# Altium project BW1098OAK.PrjPcb (part 4 of 5)

## Sheet BW1098OAK_USB.SchDoc: =project_title
size Tabloid; PageSetup: Record=PageOptions|CenterHorizontal=True|CenterVertical=True|PrintScale=0.73|XCorrection=1.00|YCorrection=1.00|PrintKind=0|BorderSize=5000000|LeftOffset=0|BottomOffset=0|Orientation=2|PaperLength=1000|PaperWidth=1000|Scale=100|PaperSource=7|PrintQuality=-4|MediaType=1|DitherType=10|PaperKind=A4|PrintScaleMode=1; CompanyName: Luxonis Holding; DrawnBy: Brian Weinstein; Organization: Luxonis Holding; Address1: 1925 Harmony Park Drive; Address2: Westminster, CO; Address3: 80234; Address4: United States; DocumentNumber: DXXXX; Revision: R1M0E1; SheetNumber: 11; SheetTotal: 11
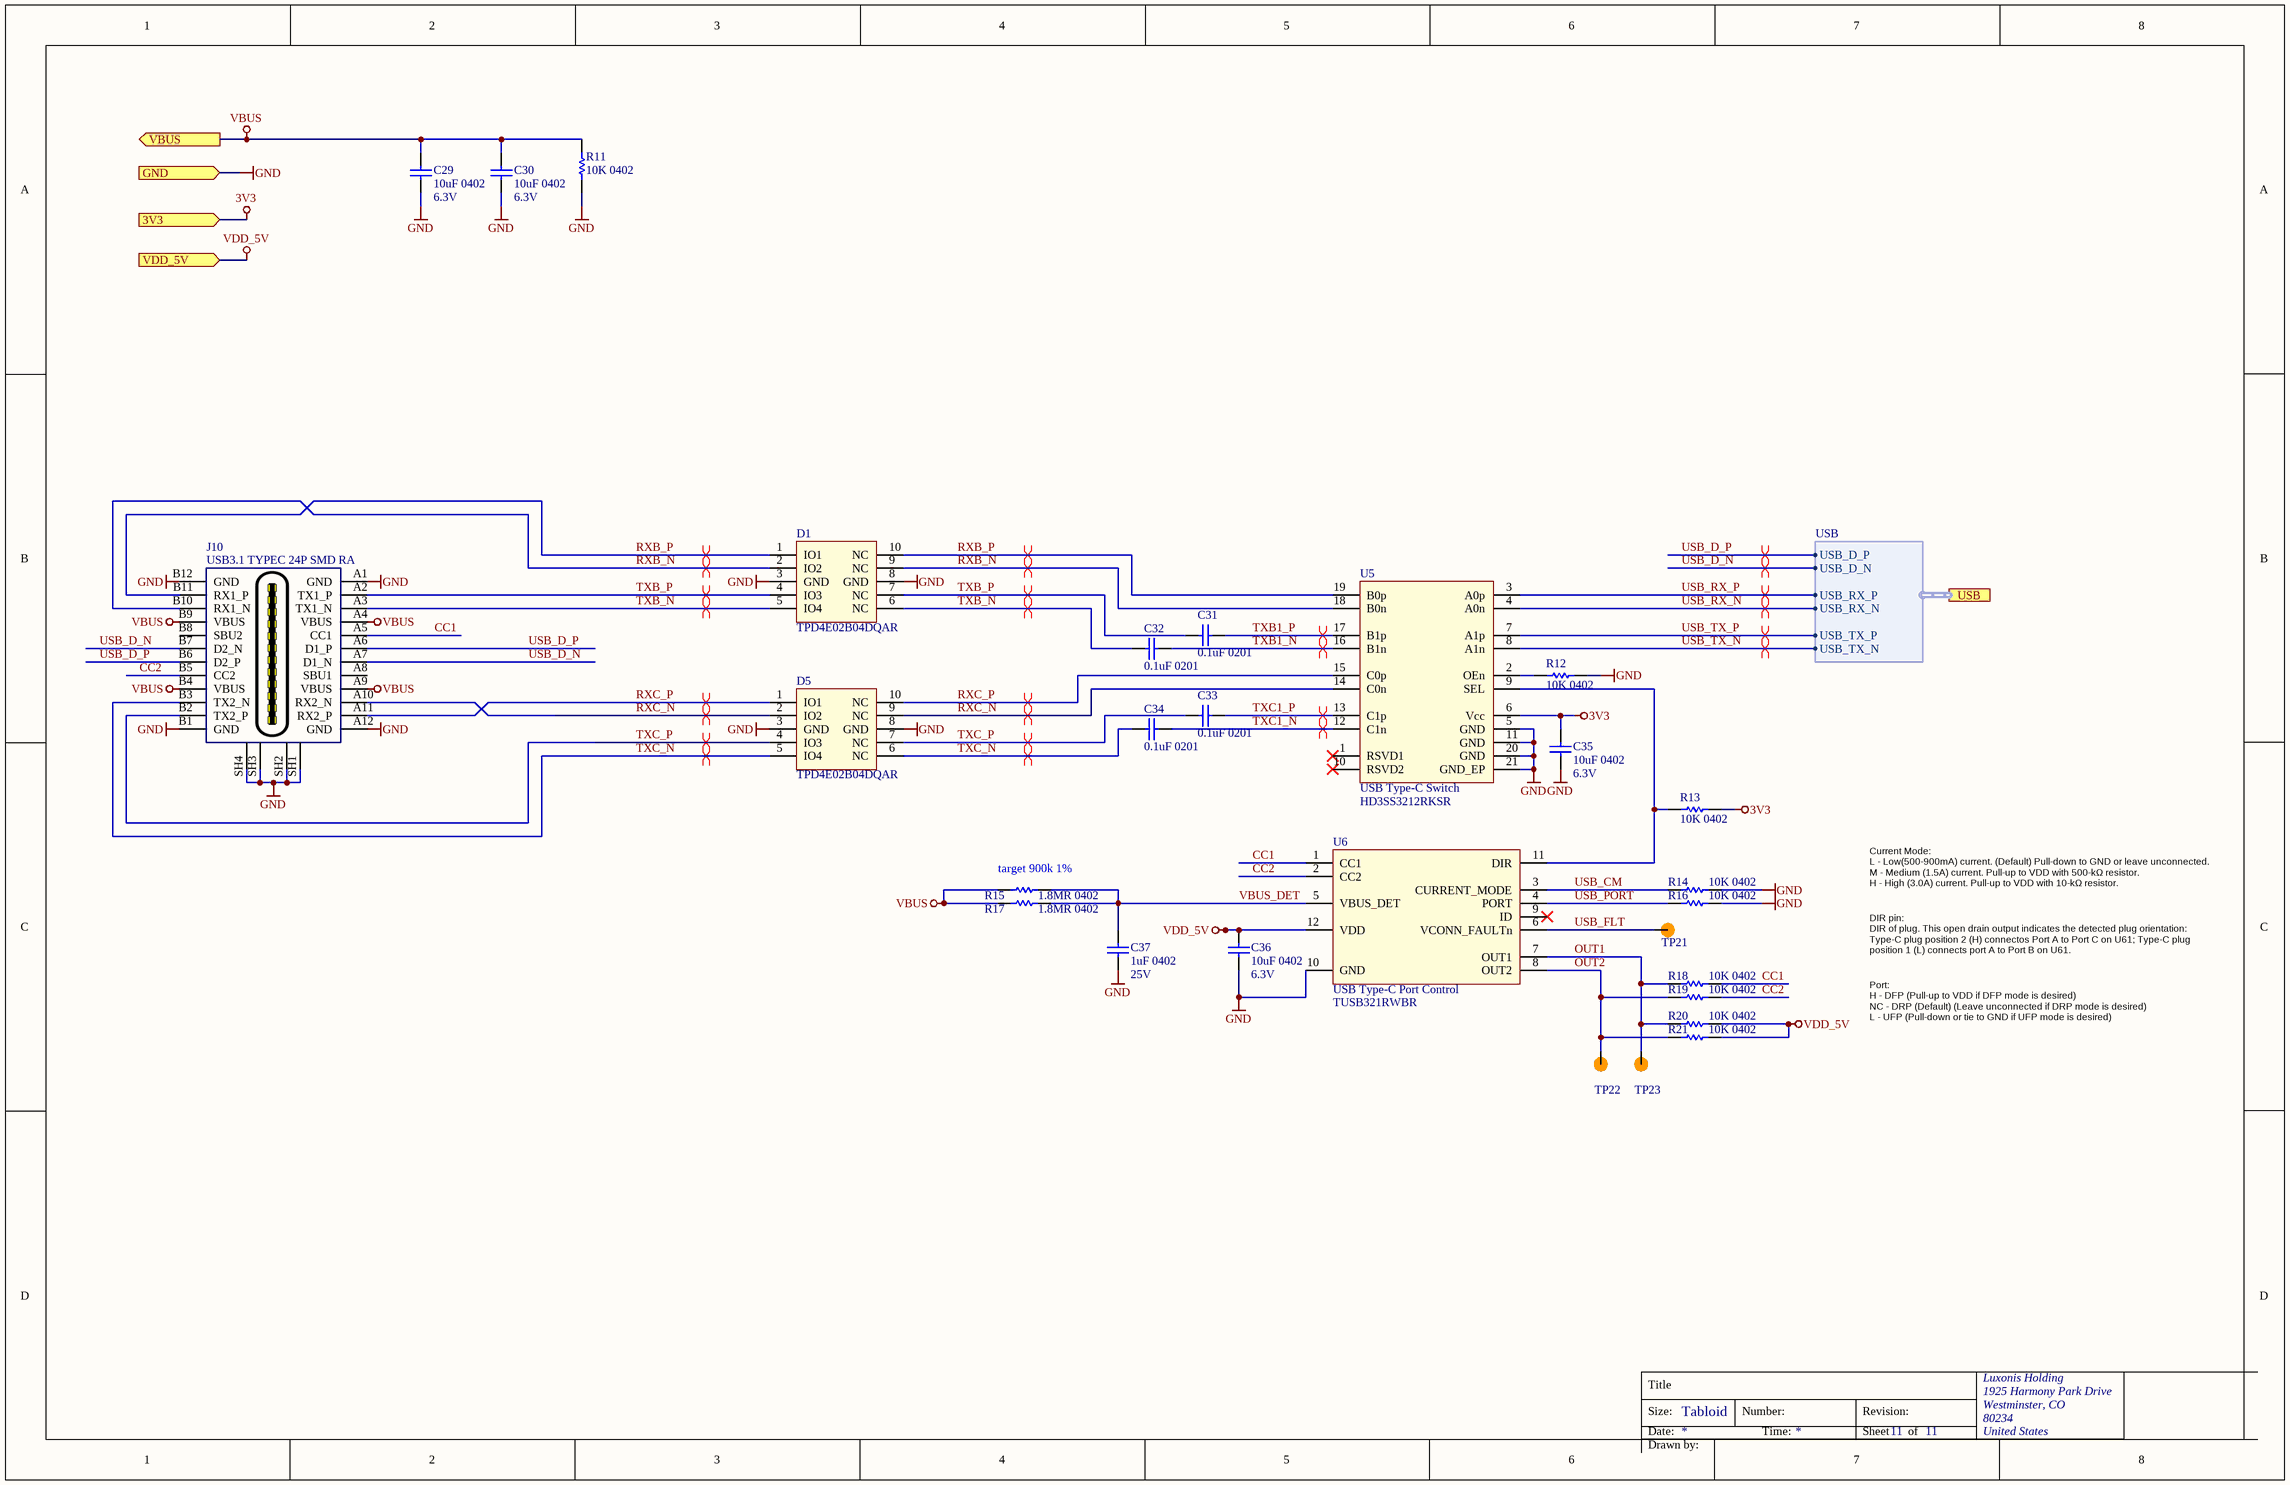
[diagram p6: BW1098OAK_USB.SchDoc]

### Parts
C29  10uF 0402  Voltage Rating: 6.3V  [CAPC0402(1005)70_L]
C30  10uF 0402  Voltage Rating: 6.3V  [CAPC0402(1005)70_L]
C31  0.1uF 0201  [CAPC0201(0603)33_L]
C32  0.1uF 0201  [CAPC0201(0603)33_L]
C33  0.1uF 0201  [CAPC0201(0603)33_L]
C34  0.1uF 0201  [CAPC0201(0603)33_L]
C35  10uF 0402  Voltage Rating: 6.3V  [CAPC0402(1005)70_L]
C36  10uF 0402  Voltage Rating: 6.3V  [CAPC0402(1005)70_L]
C37  1uF 0402  Voltage Rating: 25V  [CAPC0402(1005)70_N]
D1  TPD4E02B04DQAR  [TPD4E02B04DQAR]
D5  TPD4E02B04DQAR  [TPD4E02B04DQAR]
J10  USB3.1 TYPEC 24P SMD RA  [105450-0101]
R11  10K 0402  [RESC0402(1005)_L]
R12  10K 0402  [RESC0402(1005)_L]
R13  10K 0402  [RESC0402(1005)_L]
R14  10K 0402  [RESC0402(1005)_L]
R15  1.8MR 0402  [RESC0402(1005)_L]
R16  10K 0402  [RESC0402(1005)_L]
R17  1.8MR 0402  [RESC0402(1005)_L]
R18  10K 0402  [RESC0402(1005)_L]
R19  10K 0402  [RESC0402(1005)_L]
R20  10K 0402  [RESC0402(1005)_L]
R21  10K 0402  [RESC0402(1005)_L]
TP21  TP100_200_NS  [TP100_200_NS]  (value not drawn)  (no BOM)
TP22  TP100_200_NS  [TP100_200_NS]  (value not drawn)  (no BOM)
TP23  TP100_200_NS  [TP100_200_NS]  (value not drawn)  (no BOM)
U5  USB Type-C Switch  [HD3SS3212RKSR]
U6  USB Type-C Port Control  [TUSB321RWBR]

### Ports
3V3 (in), GND (in), USB (harness USB), VBUS (out), VDD_5V (in)

### Harnesses
USB: USB_D_P, USB_D_N, USB_TX_N, USB_TX_P, USB_RX_N, USB_RX_P

### Nets
3V3: C35.2 R13.2 U5.6(Vcc) ; port 3V3
GND: C29.1 C30.1 C35.1 C36.1 C37.1 D1.3(GND) D1.8(GND) D5.3(GND) D5.8(GND) J10.A1(GND) J10.A12(GND) J10.B1(GND) J10.B12(GND) J10.SH1(SH) J10.SH2(SH) J10.SH3(SH) J10.SH4(SH) R11.1 R12.2 R14.2 R16.2 U5.5(GND) U5.11(GND) U5.20(GND) U5.21(GND_EP) U6.10(GND) ; port GND
VBUS: C29.2 C30.2 J10.A4(VBUS) J10.A9(VBUS) J10.B4(VBUS) J10.B9(VBUS) R11.2 R15.1 R17.1 ; port VBUS
VDD_5V: C36.2 R20.2 R21.2 U6.12(VDD) ; port VDD_5V
CC1: J10.A5(CC1) R18.2 U6.1(CC1)
CC2: J10.B5(CC2) R19.2 U6.2(CC2)
OUT1: R18.1 R20.1 TP23.1 U6.7(OUT1)
OUT2: R19.1 R21.1 TP22.1 U6.8(OUT2)
RXB_N: D1.2(IO2) D1.9(NC) J10.B10(RX1_N) U5.18(B0n)
RXB_P: D1.1(IO1) D1.10(NC) J10.B11(RX1_P) U5.19(B0p)
RXC_N: D5.2(IO2) D5.9(NC) J10.A10(RX2_N) U5.14(C0n)
RXC_P: D5.1(IO1) D5.10(NC) J10.A11(RX2_P) U5.15(C0p)
TXB1_N: C32.2 U5.16(B1n)
TXB1_P: C31.2 U5.17(B1p)
TXB_N: C32.1 D1.5(IO4) D1.6(NC) J10.A3(TX1_N)
TXB_P: C31.1 D1.4(IO3) D1.7(NC) J10.A2(TX1_P)
TXC1_N: C34.2 U5.12(C1n)
TXC1_P: C33.2 U5.13(C1p)
TXC_N: C34.1 D5.5(IO4) D5.6(NC) J10.B3(TX2_N)
TXC_P: C33.1 D5.4(IO3) D5.7(NC) J10.B2(TX2_P)
USB_CM: R14.1 U6.3(CURRENT_MODE)
USB_D_N: J10.A7(D1_N) J10.B7(D2_N) ; port USB.USB_D_N
USB_D_P: J10.A6(D1_P) J10.B6(D2_P) ; port USB.USB_D_P
USB_FLT: TP21.1 U6.6(VCONN_FAULTn)
USB_PORT: R16.1 U6.4(PORT)
USB_RX_N: U5.4(A0n) ; port USB.USB_RX_N
USB_RX_P: U5.3(A0p) ; port USB.USB_RX_P
USB_TX_N: U5.8(A1n) ; port USB.USB_TX_N
USB_TX_P: U5.7(A1p) ; port USB.USB_TX_P
VBUS_DET: C37.2 R15.2 R17.2 U6.5(VBUS_DET)
NetR12_1: R12.1 U5.2(OEn)
NetR13_1: R13.1 U5.9(SEL) U6.11(DIR)

Not connected (* = marked no-connect by the designer): J10 A8(SBU1) B8(SBU2); U5 1(RSVD1)* 10(RSVD2)*; U6 9(ID)*

### Layout directives
differential pair; differential pair class USB3: RXB_N, RXB_P, RXC_N, RXC_P, TXB1_N, TXB1_P, TXB_N, TXB_P, TXC1_N, TXC1_P, TXC_N, TXC_P, USB_D_N, USB_D_P, USB_RX_N, USB_RX_P, USB_TX_N, USB_TX_P

### Notes on the sheet
- (near R15) target 900k 1%
- Current Mode:
  L - Low(500-900mA) current. (Default) Pull-down to GND or leave unconnected.
  M - Medium (1.5A) current. Pull-up to VDD with 500-kΩ resistor.
  H - High (3.0A) current. Pull-up to VDD with 10-kΩ resistor.
- DIR pin:
  DIR of plug. This open drain output indicates the detected plug orientation: Type-C plug position 2 (H) connectos Port A to Port C on U61; Type-C plug position 1 (L) connects port A to Port B on U61.
- Port:
  H - DFP (Pull-up to VDD if DFP mode is desired)
  NC - DRP (Default) (Leave unconnected if DRP mode is desired)
  L - UFP (Pull-down or tie to GND if UFP mode is desired)
- Title
- Size:
- Date:
- Tabloid
- Number:
- Time:
- Revision:
- Sheet
- of
- Drawn by:

### Library data of the parts
C29 C30 C35 C36 = GRM155R60J106ME15D: CAP CER 10UF 6.3V X5R 0402 20%; Manufacturer 1: Murata; Supplier 1: Digi-Key; Manufacturer Part Number 1: GRM155R60J106ME15D; Stock 1: 1839627; Pricing 1: 1=0.23000, 10=0.15700, 100=0.07950, 500=0.05442, 1000=0.04814, 2500=0.04605, 5000=0.04186 (USD); RoHS: Yes; Mount: Surface Mount; Case/Package: 0402; Case Code (Metric): 1005; Case Code (Imperial): 0402; Min Operating Temperature: -55°C; Max Operating Temperature: 85°C; Packaging: Tape and Reel; Capacitance: 10uF; Dielectric: X5R; Length: 0.039inch; Width: 0.02inch; ComponentLink1URL: https://www.murata.com/~/media/webrenewal/support/library/catalog/products/capacitor/mlcc/c02e.ashx?la=en-us&src-supplier=Digi-Key; ComponentLink1Description: https://www.murata.com/~/media/webrenewal/support/library/catalog/products/capacitor/mlcc/c02e.ashx?la=en-us&src-supplier=Digi-Key; Supplier Part Number 1: 490-13238-1-ND; Voltage Rating (DC): 6.3V; Thickness: 0.026inch; Tolerance: 20%
C31-C34 = GRM033R61A104KE15D: CAP CER 0.1UF 10V X5R 0201; Manufacturer 1: Murata; Capacitance: 100nF; Tolerance: 10%; Supplier 1: Digi-Key; Manufacturer Part Number 1: GRM033R61A104KE15D; Stock 1: 45335312; Pricing 1: 1=0.10000, 10=0.04200, 100=0.01860, 500=0.01330, 1000=0.01045, 2500=0.00950, 5000=0.00874 (USD); RoHS: Yes; Mount: Surface Mount; Case/Package: 0201; Weight: 6E-06oz; Case Code (Metric): 0603; Case Code (Imperial): 0201; Min Operating Temperature: -55°C; Max Operating Temperature: 85°C; Packaging: Tape and Reel; Voltage Rating: 10V; Package Quantity: 1; Voltage Rating (DC): 10V; Dielectric: X5R; Termination: SMD/SMT; Length: 0.6mm; Height: 0.3mm; Width: 0.012inch; Thickness: 0.013inch; Depth: 0.3mm; Radiation Hardening: No; Lead Free: Lead Free; REACH SVHC: No SVHC; ComponentLink1URL: https://datasheet.ciiva.com/26843/getdatasheetpartid-308656-26843739.pdf?src-supplier=Verical; ComponentLink1Description: https://datasheet.ciiva.com/26843/getdatasheetpartid-308656-26843739.pdf?src-supplier=Verical; ComponentLink2URL: https://datasheet.ciiva.com/5413/product-5413117.pdf?src-supplier=Mouser; ComponentLink2Description: https://datasheet.ciiva.com/5413/product-5413117.pdf?src-supplier=Mouser; ComponentLink3URL: https://datasheet.ciiva.com/6256/partnumbering-e-01-6256406.pdf?src-supplier=Digi-Key; ComponentLink3Description: https://datasheet.ciiva.com/6256/partnumbering-e-01-6256406.pdf?src-supplier=Digi-Key; ComponentLink4URL: https://datasheet.ciiva.com/6256/partnumbering-e-01-6256407.pdf?src-supplier=Digi-Key; ComponentLink4Description: https://datasheet.ciiva.com/6256/partnumbering-e-01-6256407.pdf?src-supplier=Digi-Key; ComponentLink5URL: https://datasheet.ciiva.com/6256/partnumbering-e-01-6256408.pdf?src-supplier=Digi-Key; ComponentLink5Description: https://datasheet.ciiva.com/6256/partnumbering-e-01-6256408.pdf?src-supplier=Digi-Key; Supplier Part Number 1: 490-5881-1-ND; Voltage: 10V
C37 = GRM155R61E105KA12D: CAP CER 1UF 25V X5R 0402 10%; Manufacturer 1: Murata; Material: Ceramic; Supplier 1: Digi-Key; Manufacturer Part Number 1: GRM155R61E105KA12D; Stock 1: 200653; Pricing 1: 1=0.10000, 10=0.07100, 100=0.03350, 500=0.02352, 1000=0.01947, 2500=0.01812, 5000=0.01658 (USD); RoHS: Yes; Mount: Surface Mount; Case/Package: 0402; Weight: 0.000212oz; Case Code (Metric): 1005; Case Code (Imperial): 0402; Min Operating Temperature: -55°C; Max Operating Temperature: 85°C; Tolerance: 10%; Capacitance: 1uF; Dielectric: X5R; Voltage Rating (DC): 25V; Packaging: Tape and Reel; Package Quantity: 10000; Termination: SMD/SMT; Voltage: 25V; Length: 1mm; Height: 0.5mm; Width: 0.5mm; Thickness: 0.022inch; Depth: 0.5mm; Lead Free: Lead Free; REACH SVHC: No SVHC; ComponentLink1URL: https://datasheet.ciiva.com/22732/1666664-22732122.pdf?src-supplier=Element14; ComponentLink1Description: https://datasheet.ciiva.com/22732/1666664-22732122.pdf?src-supplier=Element14; ComponentLink2URL: https://datasheet.ciiva.com/7719/1666664-7719006.pdf?src-supplier=Element14; ComponentLink2Description: https://datasheet.ciiva.com/7719/1666664-7719006.pdf?src-supplier=Element14; Supplier Part Number 1: 490-10017-1-ND; Supplier 2: Arrow; Supplier 3: TTI; Supplier Part Number 2: GRM155R61E105KA12D; Supplier Part Number 3: GRM155R61E105KA12D
D1 D5 = TPD4E02B04DQAR: TVS DIODE 3.6V 8.8V 10USON 8.8V (Typ) Clamp 5A (8/20µs) Ipp Tvs Diode Surface Mount 10-USON (2.5x1); Manufacturer 1: Texas Instruments; Number of Bidirectional Channels: 4; Min Breakdown Voltage: 5.5V; Peak Pulse Power: 17W; Power Line Protection: No; Interface: USB,HDMI; Supplier 1: Digi-Key; Manufacturer Part Number 1: TPD4E02B04DQAR; Stock 1: 25615; Pricing 1: 1=0.69000, 10=0.60800, 100=0.46650, 500=0.36874, 1000=0.29499 (USD); RoHS: Yes; Mount: Surface Mount; Number of Pins: 10; Min Operating Temperature: -40°C; Max Operating Temperature: 125°C; Packaging: Cut Tape; Reverse Standoff Voltage: 3.6V; Clamping Voltage: 8.8V; Operating Supply Voltage: 3.6V; Peak Pulse Current: 5A; Number of Channels: 4; Composition: Zener; REACH SVHC: No SVHC; Lead Free: Lead Free; ComponentLink1URL: http://www.ti.com/general/docs/lit/getliterature.tsp?genericPartNumber=TPD4E02B04&amp;&amp;fileType=pdf&src-supplier=Element14; ComponentLink1Description: http://www.ti.com/general/docs/lit/getliterature.tsp?genericPartNumber=TPD4E02B04&amp;&amp;fileType=pdf&src-supplier=Element14; ComponentLink2URL: http://www.ti.com/lit/ds/symlink/tpd4e02b04.pdf?src-supplier=Farnell; ComponentLink2Description: http://www.ti.com/lit/ds/symlink/tpd4e02b04.pdf?src-supplier=Farnell; ComponentLink3URL: http://www.ti.com/lit/ds/symlink/tpd4e02b04.pdf?src-supplier=Newark; ComponentLink3Description: http://www.ti.com/lit/ds/symlink/tpd4e02b04.pdf?src-supplier=Newark; ComponentLink4URL: http://www.ti.com/lit/ds/symlink/tpd4e02b04.pdf?src-supplier=Digi-Key; ComponentLink4Description: http://www.ti.com/lit/ds/symlink/tpd4e02b04.pdf?src-supplier=Digi-Key; Supplier Part Number 1: 296-43875-1-ND
J10 = 105450-0101: CONN RCP USB3.1 TYPEC 24P SMD RA; Manufacturer 1: Molex; Connector Type: USB; Number of Contacts: 24; Gender: Receptacle; Number of Ports: 1; Current Rating: 5A; Mating Cycles: 10000; Shielding: Shielded; Pitch: 0.5mm; Supplier 1: Digi-Key; Manufacturer Part Number 1: 105450-0101; Stock 1: 13882; Pricing 1: 1=2.15000, 10=1.94900, 25=1.82960, 50=1.75000, 100=1.67050, 250=1.51140, 500=1.39208 (USD); RoHS: Yes; Mount: Surface Mount,Through Hole,Horizontal; Case/Package: 0101; Number of Pins: 24; Contact Material: Copper Alloy; Contact Plating: Gold; Number of Terminals: 24; Housing Material: Thermoplastic; Insulation Color: Black; Min Operating Temperature: -30°C; Max Operating Temperature: 85°C; Packaging: Tape and Reel; Orientation: Right Angle; Termination: Solder; USB Standard: USB 3.1; Features: Shielded; Length: 8.94mm; REACH SVHC: Unknown; Flammability Rating: UL94 V-0; ComponentLink1URL: http://www.farnell.com/datasheets/2673427.pdf?src-supplier=Farnell; ComponentLink1Description: http://www.farnell.com/datasheets/2673427.pdf?src-supplier=Farnell; ComponentLink2URL: http://www.farnell.com/datasheets/2801634.pdf?src-supplier=Farnell; ComponentLink2Description: http://www.farnell.com/datasheets/2801634.pdf?src-supplier=Farnell; ComponentLink3URL: http://www.farnell.com/datasheets/2672741.pdf?src-supplier=Newark; ComponentLink3Description: http://www.farnell.com/datasheets/2672741.pdf?src-supplier=Newark; ComponentLink4URL: https://www.molex.com/pdm_docs/sd/1054500101_sd.pdf?src-supplier=Digi-Key; ComponentLink4Description: https://www.molex.com/pdm_docs/sd/1054500101_sd.pdf?src-supplier=Digi-Key; ComponentLink5URL: https://www.molex.com/pdm_docs/ps/PS-105448-001.pdf?src-supplier=Digi-Key; ComponentLink5Description: https://www.molex.com/pdm_docs/ps/PS-105448-001.pdf?src-supplier=Digi-Key; ComponentLink6URL: http://www.farnell.com/datasheets/2015275.pdf?src-supplier=Element14; ComponentLink6Description: http://www.farnell.com/datasheets/2015275.pdf?src-supplier=Element14; ComponentLink7URL: http://www.literature.molex.com/SQLImages/kelmscott/Molex/PDF_Images/987651-4081.PDF?src-supplier=Avnet; ComponentLink7Description: http://www.literature.molex.com/SQLImages/kelmscott/Molex/PDF_Images/987651-4081.PDF?src-supplier=Avnet; ComponentLink8URL: http://www.literature.molex.com/SQLImages/kelmscott/Molex/PDF_Images/987651-4081.PDF?src-supplier=Avnet+Asia; ComponentLink8Description: http://www.literature.molex.com/SQLImages/kelmscott/Molex/PDF_Images/987651-4081.PDF?src-supplier=Avnet+Asia; Supplier Part Number 1: WM12856CT-ND; Supplier 2: Newark; Supplier 3: Mouser; Supplier Part Number 2: 02AH5567; Supplier Part Number 3: 538-105450-0101
R11-R14 R16 R18-R21 = RC0402FR-1310KL: as R1 on sheet BW1098OAK_IMX378; ComponentLink1URL: https://datasheet.ciiva.com/16940/pyu-rc0402-51-rohs-l-6-16940293.pdf?src-supplier=Avnet+Europe; ComponentLink1Description: https://datasheet.ciiva.com/16940/pyu-rc0402-51-rohs-l-6-16940293.pdf?src-supplier=Avnet+Europe; ComponentLink2URL: https://datasheet.ciiva.com/28386/pyu-rc0402-51-rohs-l-6-28386855.pdf?src-supplier=Avnet+Europe; ComponentLink2Description: https://datasheet.ciiva.com/28386/pyu-rc0402-51-rohs-l-6-28386855.pdf?src-supplier=Avnet+Europe; ComponentLink3URL: https://datasheet.ciiva.com/16740/pyu-rc0402-51-rohs-l-6-r-16740602.pdf?src-supplier=Future+Electronics; ComponentLink3Description: https://datasheet.ciiva.com/16740/pyu-rc0402-51-rohs-l-6-r-16740602.pdf?src-supplier=Future+Electronics; ComponentLink4URL: https://datasheet.ciiva.com/8891/pyu-rc0402-51-rohs-l-6-8891339.pdf?src-supplier=Avnet; ComponentLink4Description: https://datasheet.ciiva.com/8891/pyu-rc0402-51-rohs-l-6-8891339.pdf?src-supplier=Avnet; ComponentLink5URL: https://datasheet.ciiva.com/5557/pyu-rc0402-51-rohs-l-6-r-5557997.pdf?src-supplier=Mouser; ComponentLink5Description: https://datasheet.ciiva.com/5557/pyu-rc0402-51-rohs-l-6-r-5557997.pdf?src-supplier=Mouser; ComponentLink6URL: https://datasheet.ciiva.com/7983/1018594-7983533.pdf?src-supplier=Element14; ComponentLink6Description: https://datasheet.ciiva.com/7983/1018594-7983533.pdf?src-supplier=Element14; Supplier 1: Newark; Manufacturer Part Number 1: RC0402FR-1310KL; Stock 1: 62239; Pricing 1: 1=0.10000, 25=0.01200, 100=0.00400, 250=0.00400, 500=0.00300, 1000=0.00300 (USD); RoHS: Yes; Case/Package: 0402; Number of Pins: 2; Contact Plating: Tin,Matte,Lead; Case Code (Imperial): 0402; Case Code (Metric): 1005; Min Operating Temperature: -55°C; Max Operating Temperature: 155°C; Tolerance: 1%; Composition: Thick Film; Packaging: Tape and Reel; Termination: SMD/SMT; Military Standard: Not; Voltage Rating (DC): 50V; Working Voltage: 50V; Number of Terminations: 2; Length: 1mm; Depth: 0.5mm; Radiation Hardening: No; REACH SVHC: No SVHC; Lead Free: Lead Free; Supplier Part Number 1: 67R9960; Supplier 2: Future Electronics; Supplier 3: Mouser; Supplier 4: Element14; Supplier Part Number 2: RC0402FR-1310KL-CUTT; Supplier Part Number 3: 603-RC0402FR-1310KL; Supplier Part Number 4: 1799235
R15 R17 = CRCW04021M80FKED: RES SMD 1.8M OHM 1% 1/16W 0402; Manufacturer 1: Vishay; Voltage Rating: 50V; Temperature Coefficient: 100ppm/°C; Power Rating: 63mW; Supplier 1: Digi-Key; Manufacturer Part Number 1: CRCW04021M80FKED; Stock 1: 26061; Pricing 1: 1=0.10000, 10=0.03800, 100=0.01540, 1000=0.00690, 2500=0.00599, 5000=0.00495 (USD); RoHS: Yes; Mount: Surface Mount; Case/Package: 0402; Number of Pins: 2; Weight: 2.3E-05oz; Case Code (Imperial): 0402; Case Code (Metric): 1005; Contact Plating: Tin; Min Operating Temperature: -55°C; Max Operating Temperature: 155°C; Packaging: Tape and Reel; Package Quantity: 10000; Termination: SMD/SMT; Voltage Rating (DC): 50V; Composition: Thick Film; Tolerance: 1%; Military Standard: Not; Resistance: 1.8MR; Length: 1mm; Height: 0.35mm; Width: 0.5mm; Depth: 0.5mm; Radiation Hardening: No; Lead Free: Lead Free; REACH SVHC: Unknown; ComponentLink1URL: https://datasheet.ciiva.com/11812/0900766b80d98824-11812579.pdf?src-supplier=RSComponents; ComponentLink1Description: https://datasheet.ciiva.com/11812/0900766b80d98824-11812579.pdf?src-supplier=RSComponents; ComponentLink2URL: https://datasheet.ciiva.com/16886/dcrcwe3-16886536.pdf?src-supplier=Avnet+Europe; ComponentLink2Description: https://datasheet.ciiva.com/16886/dcrcwe3-16886536.pdf?src-supplier=Avnet+Europe; ComponentLink3URL: https://datasheet.ciiva.com/7800/1697337-7800987.pdf?src-supplier=Element14; ComponentLink3Description: https://datasheet.ciiva.com/7800/1697337-7800987.pdf?src-supplier=Element14; ComponentLink4URL: https://datasheet.ciiva.com/16786/70201119-16786875.pdf?src-supplier=Allied+Electronics; ComponentLink4Description: https://datasheet.ciiva.com/16786/70201119-16786875.pdf?src-supplier=Allied+Electronics; ComponentLink5URL: https://datasheet.ciiva.com/22676/1700796-22676027.pdf?src-supplier=Element14; ComponentLink5Description: https://datasheet.ciiva.com/22676/1700796-22676027.pdf?src-supplier=Element14; ComponentLink6URL: https://datasheet.ciiva.com/7800/1697337-7800988.pdf?src-supplier=Element14; ComponentLink6Description: https://datasheet.ciiva.com/7800/1697337-7800988.pdf?src-supplier=Element14; ComponentLink7URL: https://datasheet.ciiva.com/26316/fld-crcw-e3-data-en-26316605.pdf?src-supplier=Distrelec; ComponentLink7Description: https://datasheet.ciiva.com/26316/fld-crcw-e3-data-en-26316605.pdf?src-supplier=Distrelec; ComponentLink8URL: https://datasheet.ciiva.com/8336/dcrcwe3-8336646.pdf?src-supplier=Avnet; ComponentLink8Description: https://datasheet.ciiva.com/8336/dcrcwe3-8336646.pdf?src-supplier=Avnet; Supplier Part Number 1: 541-1.80MLCT-ND
TP21-TP23 = TEST_POINT
U5 = HD3SS3212RKSR: IC MUX 2:1 8 OHM 20VQFN; Manufacturer 1: Texas Instruments; Bandwidth: 8GHz; Min Supply Voltage: 3V; Max Supply Voltage: 3.6V; Data Rate: 480Mbps; Number of Ports: 3; USB Standard: USB 3.1; Supplier 1: Digi-Key; Manufacturer Part Number 1: HD3SS3212RKSR; Stock 1: 36674; Pricing 1: 1=1.79000, 10=1.61000, 100=1.29440, 500=1.06348, 1000=0.88117 (USD); RoHS: Yes; Mount: Standard; Case/Package: VQFN; Number of Pins: 20; Min Operating Temperature: 0°C; Max Operating Temperature: 70°C; Packaging: Tape and Reel; Lead Free: Lead Free; REACH SVHC: No SVHC; ComponentLink1URL: http://www.ti.com/general/docs/lit/getliterature.tsp?genericPartNumber=HD3SS3212&&fileType=pdf&src-supplier=Avnet; ComponentLink1Description: http://www.ti.com/general/docs/lit/getliterature.tsp?genericPartNumber=HD3SS3212&&fileType=pdf&src-supplier=Avnet; ComponentLink2URL: http://www.ti.com/general/docs/lit/getliterature.tsp?genericPartNumber=HD3SS3212&amp;&amp;fileType=pdf&src-supplier=Farnell; ComponentLink2Description: http://www.ti.com/general/docs/lit/getliterature.tsp?genericPartNumber=HD3SS3212&amp;&amp;fileType=pdf&src-supplier=Farnell; ComponentLink3URL: http://www.ti.com/lit/ds/symlink/hd3ss3212.pdf?src-supplier=Digi-Key; ComponentLink3Description: http://www.ti.com/lit/ds/symlink/hd3ss3212.pdf?src-supplier=Digi-Key; ComponentLink4URL: http://www.ti.com/lit/gpn/hd3ss3212?src-supplier=Mouser; ComponentLink4Description: http://www.ti.com/lit/gpn/hd3ss3212?src-supplier=Mouser; ComponentLink5URL: http://www.ti.com/general/docs/lit/getliterature.tsp?genericPartNumber=HD3SS3212&&fileType=pdf&src-supplier=Element14; ComponentLink5Description: http://www.ti.com/general/docs/lit/getliterature.tsp?genericPartNumber=HD3SS3212&&fileType=pdf&src-supplier=Element14; Supplier Part Number 1: 296-42174-1-ND
U6 = TUSB321RWBR: IC USB PORT CONTROL TYPE-C 12X2Q; Manufacturer 1: Texas Instruments; Min Supply Voltage: 4.5V; Max Supply Voltage: 5.5V; Number of Ports: 1; USB Standard: USB 3.1; Supplier 1: Digi-Key; Manufacturer Part Number 1: TUSB321RWBR; Stock 1: 7746; Pricing 1: 1=2.27000, 10=2.04200, 100=1.64100, 500=1.34828, 1000=1.11714 (USD); RoHS: Yes; Mount: Surface Mount; Number of Pins: 12; Contact Plating: Gold; Min Operating Temperature: 0°C; Max Operating Temperature: 70°C; Packaging: Tape and Reel; REACH SVHC: No SVHC; Lead Free: Lead Free; ComponentLink1URL: http://www.ti.com/general/docs/lit/getliterature.tsp?genericPartNumber=TUSB321&&fileType=pdf&src-supplier=Avnet+Asia; ComponentLink1Description: http://www.ti.com/general/docs/lit/getliterature.tsp?genericPartNumber=TUSB321&&fileType=pdf&src-supplier=Avnet+Asia; ComponentLink2URL: http://www.ti.com/general/docs/lit/getliterature.tsp?genericPartNumber=TUSB321&&fileType=pdf&src-supplier=Farnell; ComponentLink2Description: http://www.ti.com/general/docs/lit/getliterature.tsp?genericPartNumber=TUSB321&&fileType=pdf&src-supplier=Farnell; ComponentLink3URL: http://www.ti.com/lit/ds/symlink/tusb321.pdf?src-supplier=Digi-Key; ComponentLink3Description: http://www.ti.com/lit/ds/symlink/tusb321.pdf?src-supplier=Digi-Key; ComponentLink4URL: http://www.ti.com/general/docs/lit/getliterature.tsp?genericPartNumber=TUSB321&&fileType=pdf&src-supplier=Element14; ComponentLink4Description: http://www.ti.com/general/docs/lit/getliterature.tsp?genericPartNumber=TUSB321&&fileType=pdf&src-supplier=Element14; ComponentLink5URL: http://www.ti.com/general/docs/lit/getliterature.tsp?genericPartNumber=TUSB321&&fileType=pdf&src-supplier=Avnet; ComponentLink5Description: http://www.ti.com/general/docs/lit/getliterature.tsp?genericPartNumber=TUSB321&&fileType=pdf&src-supplier=Avnet; Supplier Part Number 1: 296-42400-1-ND

## Sheet BW1098OAK_Project_Information.SchDoc: =project_title
size Tabloid; CompanyName: Luxonis Holding; DrawnBy: Brian Weinstein; Organization: Luxonis Holding; Address1: 1925 Harmony Park Drive; Address2: Westminster, CO; Address3: 80234; Address4: United States; DocumentNumber: DXXXX; Revision: R1M0E1; SheetNumber: 1; SheetTotal: 11
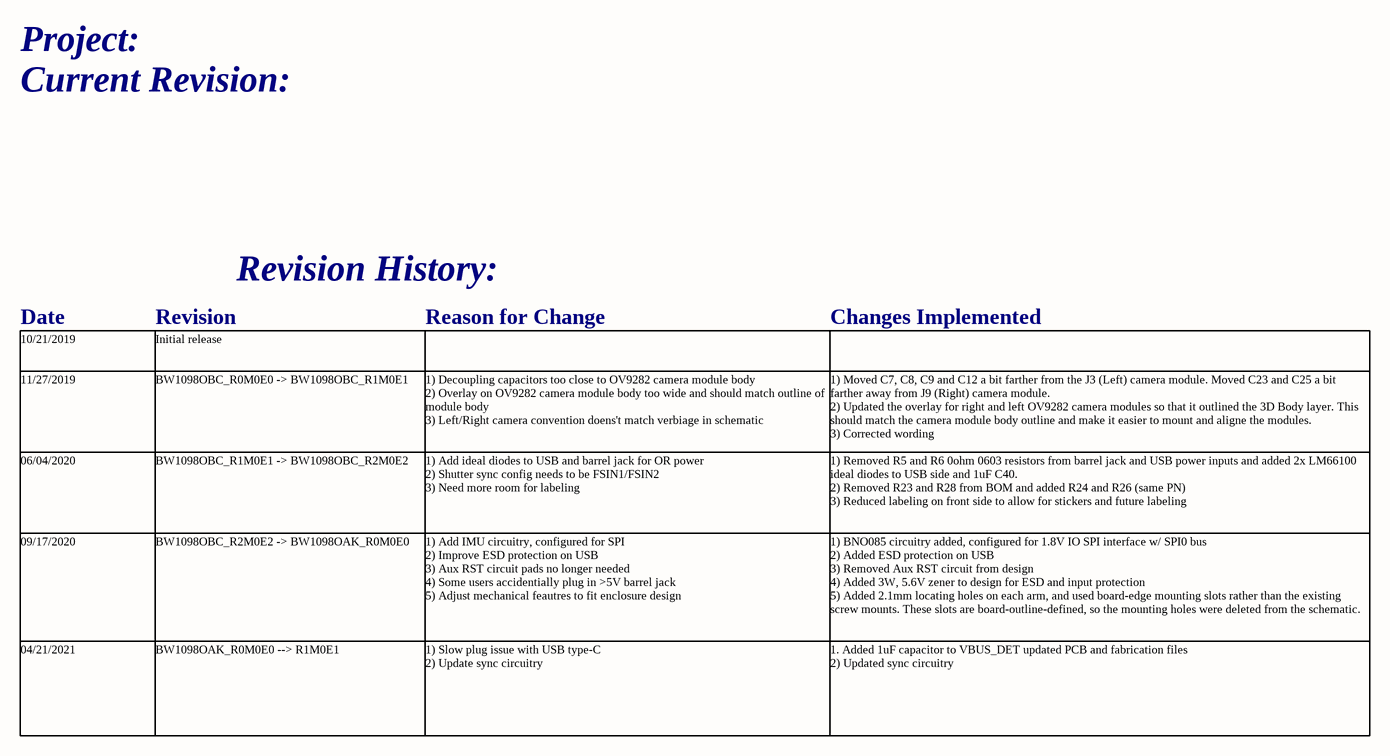
[diagram p7: BW1098OAK_Project_Information.SchDoc]

### Notes on the sheet
- Project:
- Current Revision:
- Revision History:
- 10/21/2019
- Date
- Initial release
- Revision
- Reason for Change
- Changes Implemented
- 11/27/2019
- BW1098OBC_R0M0E0 -> BW1098OBC_R1M0E1
- 1) Decoupling capacitors too close to OV9282 camera module body
  2) Overlay on OV9282 camera module body too wide and should match outline of module body
  3) Left/Right camera convention doens't match verbiage in schematic
- 1) Moved C7, C8, C9 and C12 a bit farther from the J3 (Left) camera module. Moved C23 and C25 a bit farther away from J9 (Right) camera module.
  2) Updated the overlay for right and left OV9282 camera modules so that it outlined the 3D Body layer. This should match the camera module body outline and make it easier to mount and aligne the modules.
  3) Corrected wording
- 06/04/2020
- BW1098OBC_R1M0E1 -> BW1098OBC_R2M0E2
- 1) Add ideal diodes to USB and barrel jack for OR power
  2) Shutter sync config needs to be FSIN1/FSIN2
  3) Need more room for labeling
- 1) Removed R5 and R6 0ohm 0603 resistors from barrel jack and USB power inputs and added 2x LM66100 ideal diodes to USB side and 1uF C40.
  2) Removed R23 and R28 from BOM and added R24 and R26 (same PN)
  3) Reduced labeling on front side to allow for stickers and future labeling
- 09/17/2020
- BW1098OBC_R2M0E2 -> BW1098OAK_R0M0E0
- 1) Add IMU circuitry, configured for SPI
  2) Improve ESD protection on USB
  3) Aux RST circuit pads no longer needed
  4) Some users accidentially plug in >5V barrel jack
  5) Adjust mechanical feautres to fit enclosure design
- 1) BNO085 circuitry added, configured for 1.8V IO SPI interface w/ SPI0 bus
  2) Added ESD protection on USB
  3) Removed Aux RST circuit from design
  4) Added 3W, 5.6V zener to design for ESD and input protection
  5) Added 2.1mm locating holes on each arm, and used board-edge mounting slots rather than the existing screw mounts. These slots are board-outline-defined, so the mounting holes were deleted from the schematic.
- 04/21/2021
- BW1098OAK_R0M0E0 --> R1M0E1
- 1) Slow plug issue with USB type-C
  2) Update sync circuitry
- 1. Added 1uF capacitor to VBUS_DET updated PCB and fabrication files
  2) Updated sync circuitry
- Title
- Size:
- Date:
- Tabloid
- Number:
- Time:
- Revision:
- Sheet
- of
- Drawn by:

## Sheet BW1098OAK_IMU.SchDoc: =project_title
size Tabloid; CompanyName: Luxonis Holding; DrawnBy: Brian Weinstein; Organization: Luxonis Holding; Address1: 1925 Harmony Park Drive; Address2: Westminster, CO; Address3: 80234; Address4: United States; DocumentNumber: DXXXX; Revision: R1M0E1; SheetNumber: 4; SheetTotal: 11
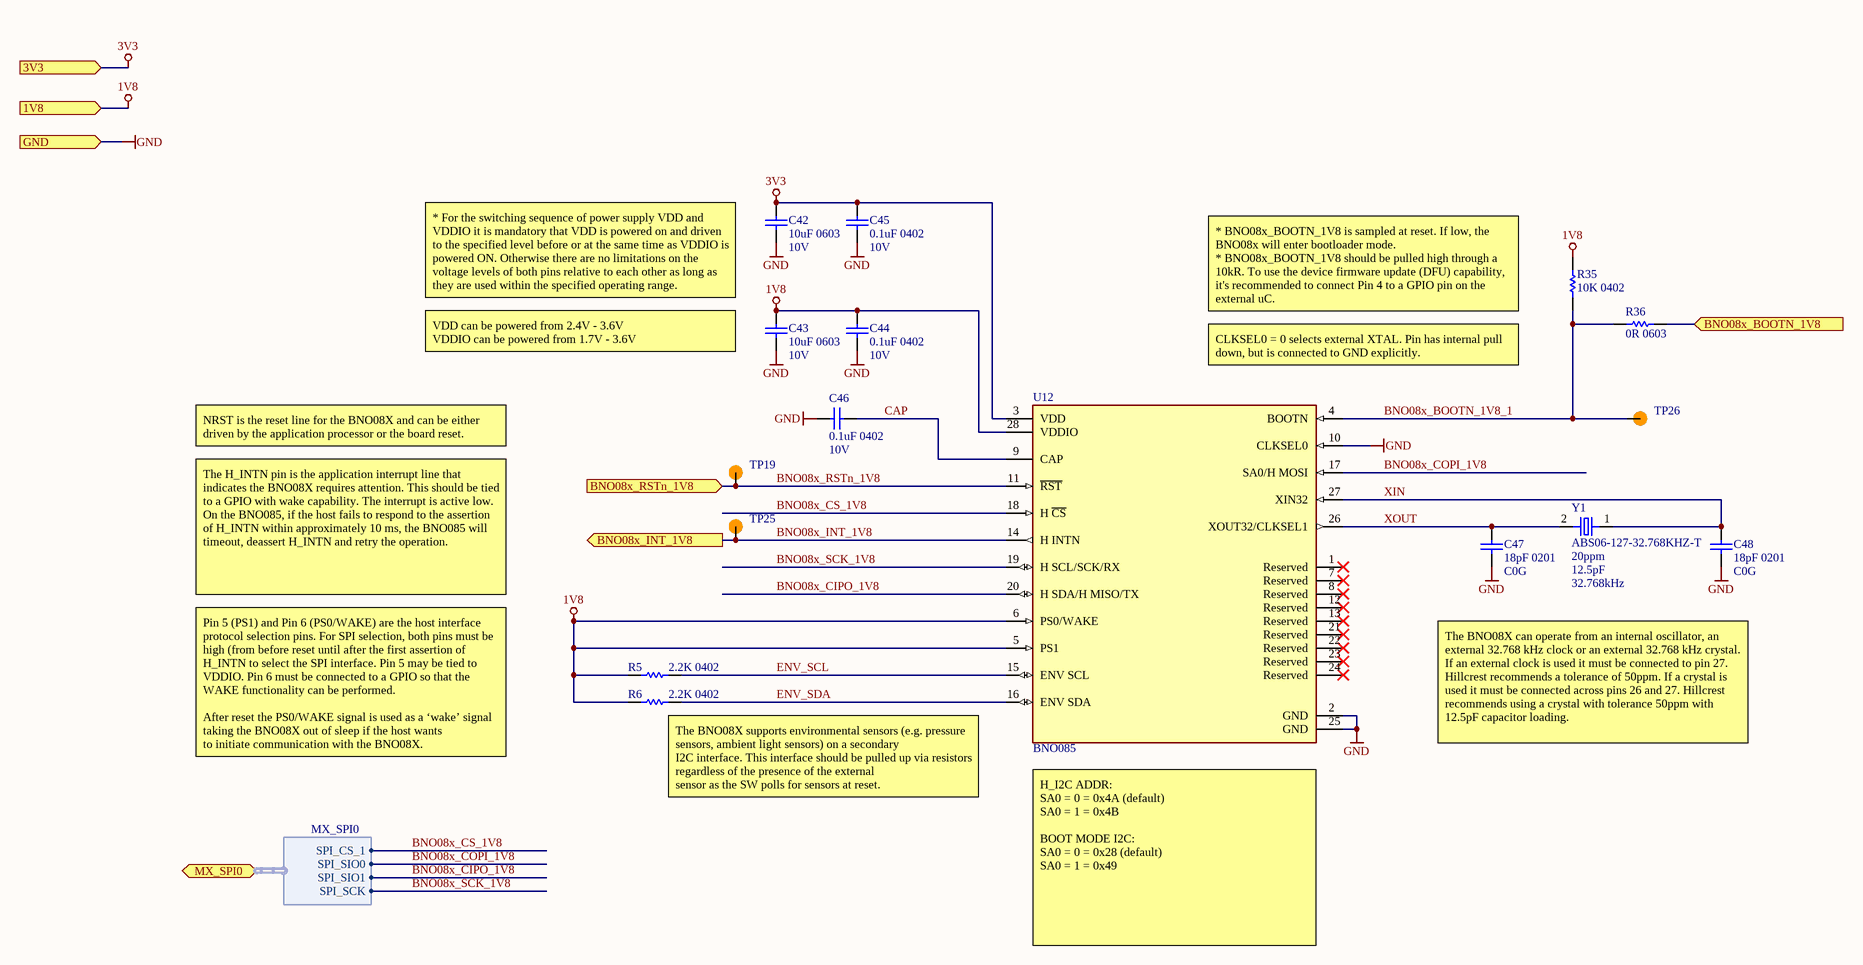
[diagram p8: BW1098OAK_IMU.SchDoc]

### Parts
C42  10uF 0603  Voltage Rating: 10V  [CAPC0603(1608)100_L]
C43  10uF 0603  Voltage Rating: 10V  [CAPC0603(1608)100_L]
C44  0.1uF 0402  Voltage Rating: 10V  [CAPC0402(1005)70_L]
C45  0.1uF 0402  Voltage Rating: 10V  [CAPC0402(1005)70_L]
C46  0.1uF 0402  Voltage Rating: 10V  [CAPC0402(1005)70_L]
C47  18pF 0201  Dielectric: C0G  [CAPC0201(0603)33_L]
C48  18pF 0201  Dielectric: C0G  [CAPC0201(0603)33_L]
R5  2.2K 0402  [RESC0402(1005)_L]
R6  2.2K 0402  [RESC0402(1005)_L]
R35  10K 0402  [RESC0402(1005)_L]
R36  0R 0603  [RESC0603(1608)_L]
TP19  TP100_200_NS  [TP100_200_NS]  (value not drawn)  (no BOM)
TP25  TP100_200_NS  [TP100_200_NS]  (value not drawn)  (no BOM)
TP26  TP100_200_NS  [TP100_200_NS]  (value not drawn)  (no BOM)
U12  BNO085  [BNO085]
Y1  ABS06-127-32.768KHZ-T  Frequency Tolerance: 20ppm  Load Capacitance: 12.5pF  Frequency: 32.768kHz  [ABS06-127-32.768KHZ-T]

### Ports
1V8 (in), 3V3 (in), BNO08x_BOOTN_1V8 (in), BNO08x_INT_1V8 (out), BNO08x_RSTn_1V8 (in), GND (in), MX_SPI0 (bidir, harness MX_SPI0)

### Harnesses
MX_SPI0: SPI_SIO0, SPI_SIO1, SPI_CS_1, SPI_SCK

### Nets
1V8: C43.2 C44.2 R5.1 R6.1 R35.2 U12.5(PS1) U12.6(PS0/WAKE) U12.28(VDDIO) ; port 1V8
3V3: C42.2 C45.2 U12.3(VDD) ; port 3V3
GND: C42.1 C43.1 C44.1 C45.1 C46.2 C47.1 C48.1 U12.2(GND) U12.10(CLKSEL0) U12.25(GND) ; port GND
BNO08x_BOOTN_1V8: R36.2 ; port BNO08x_BOOTN_1V8
BNO08x_BOOTN_1V8_1: R35.1 R36.1 TP26.1 U12.4(BOOTN)
BNO08x_CIPO_1V8: U12.20(H_SDA/H_MISO/TX) ; port MX_SPI0.SPI_SIO1
BNO08x_COPI_1V8: U12.17(SA0/H_MOSI) ; port MX_SPI0.SPI_SIO0
BNO08x_CS_1V8: U12.18(H_~{CS}) ; port MX_SPI0.SPI_CS_1
BNO08x_INT_1V8: TP25.1 U12.14(H_INTN) ; port BNO08x_INT_1V8
BNO08x_RSTn_1V8: TP19.1 U12.11(~{RST}) ; port BNO08x_RSTn_1V8
BNO08x_SCK_1V8: U12.19(H_SCL/SCK/RX) ; port MX_SPI0.SPI_SCK
CAP: C46.1 U12.9(CAP)
ENV_SCL: R5.2 U12.15(ENV_SCL)
ENV_SDA: R6.2 U12.16(ENV_SDA)
XIN: C48.2 U12.27(XIN32) Y1.1
XOUT: C47.2 U12.26(XOUT32/CLKSEL1) Y1.2

Not connected (* = marked no-connect by the designer): U12 1(Reserved)* 7(Reserved)* 8(Reserved)* 12(Reserved)* 13(Reserved)* 21(Reserved)* 22(Reserved)* 23(Reserved)* 24(Reserved)*

### Notes on the sheet
- * For the switching sequence of power supply VDD and VDDIO it is mandatory that VDD is powered on and driven to the specified level before or at the same time as VDDIO is powered ON. Otherwise there are no limitations on the voltage levels of both pins relative to each other as long as they are used within the specified operating range.
- (near C43) VDD can be powered from 2.4V - 3.6V
  VDDIO can be powered from 1.7V - 3.6V
- * BNO08x_BOOTN_1V8 is sampled at reset. If low, the BNO08x will enter bootloader mode.
  * BNO08x_BOOTN_1V8 should be pulled high through a 10kR. To use the device firmware update (DFU) capability, it's recommended to connect Pin 4 to a GPIO pin on the external uC.
- CLKSEL0 = 0 selects external XTAL. Pin has internal pull down, but is connected to GND explicitly.
- NRST is the reset line for the BNO08X and can be either driven by the application processor or the board reset.
- The H_INTN pin is the application interrupt line that indicates the BNO08X requires attention. This should be tied to a GPIO with wake capability. The interrupt is active low. On the BNO085, if the host fails to respond to the assertion of H_INTN within approximately 10 ms, the BNO085 will timeout, deassert H_INTN and retry the operation.
- Pin 5 (PS1) and Pin 6 (PS0/WAKE) are the host interface protocol selection pins. For SPI selection, both pins must be high (from before reset until after the first assertion of H_INTN to select the SPI interface. Pin 5 may be tied to VDDIO. Pin 6 must be connected to a GPIO so that the WAKE functionality can be performed.
  After reset the PS0/WAKE signal is used as a ‘wake’ signal taking the BNO08X out of sleep if the host wants
  to initiate communication with the BNO08X.
- The BNO08X can operate from an internal oscillator, an external 32.768 kHz clock or an external 32.768 kHz crystal. If an external clock is used it must be connected to pin 27. Hillcrest recommends a tolerance of 50ppm. If a crystal is used it must be connected across pins 26 and 27. Hillcrest recommends using a crystal with tolerance 50ppm with 12.5pF capacitor loading.
- (near R6) The BNO08X supports environmental sensors (e.g. pressure sensors, ambient light sensors) on a secondary
  I2C interface. This interface should be pulled up via resistors regardless of the presence of the external
  sensor as the SW polls for sensors at reset.
- (near U12) H_I2C ADDR:
  SA0 = 0 = 0x4A (default)
  SA0 = 1 = 0x4B
  BOOT MODE I2C:
  SA0 = 0 = 0x28 (default)
  SA0 = 1 = 0x49
- Title
- Size:
- Date:
- Tabloid
- Number:
- Time:
- Revision:
- Sheet
- of
- Drawn by:

### Library data of the parts
C42 C43 = GRM188R61A106ME69D: CAP CER 10UF 10V X5R 0603 20%; Manufacturer 1: Murata; Material: Ceramic; Supplier 1: Digi-Key; Manufacturer Part Number 1: GRM188R61A106ME69D; Stock 1: 2873098; Pricing 1: 1=0.21000, 10=0.14100, 100=0.07130, 500=0.04876, 1000=0.04313 (USD); RoHS: Yes; Mount: Surface Mount; Case/Package: 0603; Weight: 0.000222oz; Case Code (Metric): 1608; Case Code (Imperial): 0603; Min Operating Temperature: -55°C; Max Operating Temperature: 85°C; Packaging: Tape and Reel; Tolerance: 20%; Capacitance: 10uF; Dielectric: X5R; Voltage Rating (DC): 10V; Package Quantity: 4000; Termination: SMD/SMT; Length: 1.6mm; Height: 0.8mm; Width: 0.8mm; Thickness: 0.035inch; Depth: 0.8mm; REACH SVHC: Unknown; Lead Free: Lead Free; ComponentLink1URL: http://www.mouser.com/ds/2/281/c02e-2905.pdf?src-supplier=Mouser; ComponentLink1Description: http://www.mouser.com/ds/2/281/c02e-2905.pdf?src-supplier=Mouser; ComponentLink2URL: http://components.arrow.com/part/dataview/0323_06119472?src-supplier=Arrow+Europe; ComponentLink2Description: http://components.arrow.com/part/dataview/0323_06119472?src-supplier=Arrow+Europe; ComponentLink3URL: http://www.farnell.com/datasheets/2048014.pdf?src-supplier=Farnell; ComponentLink3Description: http://www.farnell.com/datasheets/2048014.pdf?src-supplier=Farnell; ComponentLink4URL: http://www.farnell.com/datasheets/1872210.pdf?src-supplier=Farnell; ComponentLink4Description: http://www.farnell.com/datasheets/1872210.pdf?src-supplier=Farnell; ComponentLink5URL: http://search.murata.co.jp/Ceramy/image/img/A01X/G101/ENG/GRM188R61A106ME69-01.pdf?src-supplier=Digi-Key; ComponentLink5Description: http://search.murata.co.jp/Ceramy/image/img/A01X/G101/ENG/GRM188R61A106ME69-01.pdf?src-supplier=Digi-Key; ComponentLink6URL: http://www.farnell.com/datasheets/1872210.pdf?src-supplier=Newark; ComponentLink6Description: http://www.farnell.com/datasheets/1872210.pdf?src-supplier=Newark; ComponentLink7URL: http://www.farnell.com/datasheets/2048014.pdf?src-supplier=Element14; ComponentLink7Description: http://www.farnell.com/datasheets/2048014.pdf?src-supplier=Element14; ComponentLink8URL: http://www.farnell.com/datasheets/2048014.pdf?src-supplier=Newark; ComponentLink8Description: http://www.farnell.com/datasheets/2048014.pdf?src-supplier=Newark; Supplier Part Number 1: 490-10475-1-ND
C44-C46 = GRM155R71A104JA01D: CAP CER 0.1UF 10V X7R 0402 5%; Manufacturer 1: Murata; Capacitance: 100nF; Supplier 1: Digi-Key; Manufacturer Part Number 1: GRM155R71A104JA01D; Stock 1: 1346709; Pricing 1: 1=0.10000, 10=0.02500, 100=0.01130, 500=0.00806, 1000=0.00633, 2500=0.00575, 5000=0.00529 (USD); RoHS: Yes; Mount: Surface Mount; Case/Package: 0402; Case Code (Imperial): 0402; Case Code (Metric): 1005; Min Operating Temperature: -55°C; Max Operating Temperature: 125°C; Tolerance: 5%; Packaging: Tape and Reel; Voltage Rating (DC): 10V; Dielectric: X7R; Package Quantity: 10000; Termination: SMD/SMT; Length: 1mm; Height: 0.5mm; Width: 0.02inch; Thickness: 0.022inch; Depth: 0.5mm; Radiation Hardening: No; Lead Free: Lead Free; ComponentLink1URL: https://datasheet.ciiva.com/5411/product-5411135.pdf?src-supplier=Mouser; ComponentLink1Description: https://datasheet.ciiva.com/5411/product-5411135.pdf?src-supplier=Mouser; ComponentLink2URL: https://datasheet.ciiva.com/11618/c02e-11618821.pdf?src-supplier=Avnet; ComponentLink2Description: https://datasheet.ciiva.com/11618/c02e-11618821.pdf?src-supplier=Avnet; Supplier Part Number 1: 490-10777-1-ND
C47 C48 = GRM0335C1E180FA01D: Cap Ceramic 18pF 25V C0G 1% Pad SMD 0201 125C T/R; Manufacturer 1: Murata; Supplier 1: Digi-Key; Manufacturer Part Number 1: GRM0335C1E180FA01D; RoHS: Yes; Category: Ceramic Capacitors; Stock 1: 27511; Pricing 1: 1=0.10000, 10=0.02100, 100=0.00930, 500=0.00666, 1000=0.00523, 2500=0.00476, 5000=0.00438 (USD); Mount: Surface Mount; Case/Package: 0201; Case Code (Imperial): 0201; Case Code (Metric): 0603; Min Operating Temperature: -55°C; Max Operating Temperature: 125°C; Capacitance: 18pF; Tolerance: 1%; Packaging: Tape and Reel; Voltage Rating (DC): 25V; Package Quantity: 15000; Voltage Rating: 25V; Termination: SMD/SMT; Length: 0.024inch; Height: 0.3mm; Thickness: 0.013inch; Width: 0.3mm; ComponentLink1URL: https://datasheet.ciiva.com/29538/partnumbering-e-01-29538328.pdf?src-supplier=Digi-Key; ComponentLink1Description: https://datasheet.ciiva.com/29538/partnumbering-e-01-29538328.pdf?src-supplier=Digi-Key; Supplier 2: Digi-Key; Supplier 3: Mouser; Supplier Part Number 3: 81-GRM0335C1E180FA1D; Supplier Part Number 2: 490-17804-2-ND; Supplier Part Number 1: 490-17804-1-ND
R5 R6 = RC0402FR-072K2L: RES SMD 2.2K OHM 1% 1/16W 0402; Manufacturer 1: Yageo; Resistance: 2.2kR; Temperature Coefficient: 100ppm/°C; Power Rating: 63mW; Voltage Rating: 50V; Supplier 1: Digi-Key; Manufacturer Part Number 1: RC0402FR-072K2L; Stock 1: 12579098; Pricing 1: 1=0.10000, 10=0.01600, 100=0.00640, 1000=0.00289, 2500=0.00251, 5000=0.00207 (USD); RoHS: Yes; Case/Package: 0402; Weight: 2.3E-05oz; Case Code (Imperial): 0402; Case Code (Metric): 1005; Min Operating Temperature: -55°C; Max Operating Temperature: 155°C; Packaging: Tape and Reel; Tolerance: 1%; Composition: Thick Film; Termination: SMD/SMT; Military Standard: Not; Length: 1mm; Height: 0.35mm; Width: 0.5mm; Depth: 0.5mm; Lead Free: Lead Free; REACH SVHC: Unknown; ComponentLink1URL: https://datasheet.ciiva.com/11808/0900766b80c66297-11808786.pdf?src-supplier=RSComponents; ComponentLink1Description: https://datasheet.ciiva.com/11808/0900766b80c66297-11808786.pdf?src-supplier=RSComponents; ComponentLink2URL: https://datasheet.ciiva.com/12577/pyu-rc0402-51-rohs-l-6-r-12577429.pdf?src-supplier=Mouser; ComponentLink2Description: https://datasheet.ciiva.com/12577/pyu-rc0402-51-rohs-l-6-r-12577429.pdf?src-supplier=Mouser; ComponentLink3URL: https://datasheet.ciiva.com/16741/pyu-rc0402-51-rohs-l-6-r-16741015.pdf?src-supplier=Future+Electronics; ComponentLink3Description: https://datasheet.ciiva.com/16741/pyu-rc0402-51-rohs-l-6-r-16741015.pdf?src-supplier=Future+Electronics; ComponentLink4URL: https://datasheet.ciiva.com/7983/1018594-7983515.pdf?src-supplier=Element14; ComponentLink4Description: https://datasheet.ciiva.com/7983/1018594-7983515.pdf?src-supplier=Element14; ComponentLink5URL: https://datasheet.ciiva.com/46383/1018594-46383563.pdf?src-supplier=Element14; ComponentLink5Description: https://datasheet.ciiva.com/46383/1018594-46383563.pdf?src-supplier=Element14; ComponentLink6URL: https://datasheet.ciiva.com/7849/1018594-7849928.pdf?src-supplier=Element14; ComponentLink6Description: https://datasheet.ciiva.com/7849/1018594-7849928.pdf?src-supplier=Element14; ComponentLink7URL: https://datasheet.ciiva.com/7849/1018594-7849929.pdf?src-supplier=Element14; ComponentLink7Description: https://datasheet.ciiva.com/7849/1018594-7849929.pdf?src-supplier=Element14; Supplier 2: Mouser; Supplier 3: Newark; Supplier Part Number 1: 311-2.20KLRCT-ND; Supplier Part Number 2: 603-RC0402FR-072K2L; Supplier Part Number 3: 98K7523
R35 = RC0402FR-1310KL: RES SMD 10K OHM 1% 0402 1/16W Chip Resistor, 0402 [1005 Metric], 10 kohm, RC Series, 50 V, Thick Film, 62.5 mW; Manufacturer 1: Yageo; Resistance: 10kR; Temperature Coefficient: 100ppm/°C; Power Rating: 62.5mW; Voltage Rating: 50V; ComponentLink1URL: https://datasheet.ciiva.com/16940/pyu-rc0402-51-rohs-l-6-16940293.pdf?src-supplier=Avnet+Europe; ComponentLink1Description: https://datasheet.ciiva.com/16940/pyu-rc0402-51-rohs-l-6-16940293.pdf?src-supplier=Avnet+Europe; ComponentLink2URL: https://datasheet.ciiva.com/28386/pyu-rc0402-51-rohs-l-6-28386855.pdf?src-supplier=Avnet+Europe; ComponentLink2Description: https://datasheet.ciiva.com/28386/pyu-rc0402-51-rohs-l-6-28386855.pdf?src-supplier=Avnet+Europe; ComponentLink3URL: https://datasheet.ciiva.com/16740/pyu-rc0402-51-rohs-l-6-r-16740602.pdf?src-supplier=Future+Electronics; ComponentLink3Description: https://datasheet.ciiva.com/16740/pyu-rc0402-51-rohs-l-6-r-16740602.pdf?src-supplier=Future+Electronics; ComponentLink4URL: https://datasheet.ciiva.com/8891/pyu-rc0402-51-rohs-l-6-8891339.pdf?src-supplier=Avnet; ComponentLink4Description: https://datasheet.ciiva.com/8891/pyu-rc0402-51-rohs-l-6-8891339.pdf?src-supplier=Avnet; ComponentLink5URL: https://datasheet.ciiva.com/5557/pyu-rc0402-51-rohs-l-6-r-5557997.pdf?src-supplier=Mouser; ComponentLink5Description: https://datasheet.ciiva.com/5557/pyu-rc0402-51-rohs-l-6-r-5557997.pdf?src-supplier=Mouser; ComponentLink6URL: https://datasheet.ciiva.com/7983/1018594-7983533.pdf?src-supplier=Element14; ComponentLink6Description: https://datasheet.ciiva.com/7983/1018594-7983533.pdf?src-supplier=Element14; Supplier 1: Newark; Manufacturer Part Number 1: RC0402FR-1310KL; Stock 1: 62239; Pricing 1: 1=0.10000, 25=0.01200, 100=0.00400, 250=0.00400, 500=0.00300, 1000=0.00300 (USD); RoHS: Yes; Case/Package: 0402; Number of Pins: 2; Contact Plating: Tin,Matte,Lead; Case Code (Imperial): 0402; Case Code (Metric): 1005; Min Operating Temperature: -55°C; Max Operating Temperature: 155°C; Tolerance: 1%; Composition: Thick Film; Packaging: Tape and Reel; Termination: SMD/SMT; Military Standard: Not; Voltage Rating (DC): 50V; Working Voltage: 50V; Number of Terminations: 2; Length: 1mm; Depth: 0.5mm; Radiation Hardening: No; REACH SVHC: No SVHC; Lead Free: Lead Free; Supplier Part Number 1: 67R9960; Supplier 2: Future Electronics; Supplier 3: Mouser; Supplier 4: Element14; Supplier Part Number 2: RC0402FR-1310KL-CUTT; Supplier Part Number 3: 603-RC0402FR-1310KL; Supplier Part Number 4: 1799235
R36 = CRCW06030000Z0EA: RES SMD 0 OHM JUMPER 1/10W 0603 0 Ohms Jumper 0.1W, 1/10W Chip Resistor 0603 (1608 Metric) Automotive AEC-Q200 Thick Film; Manufacturer 1: Vishay; Manufacturer Part Number 1: CRCW0603-0000Z0EA; Resistance: 0mR; Power Rating: 100mW; Voltage Rating: 75V; Temperature Coefficient: 100ppm/°C; Tolerance: 5%; Current Rating: 2A; Supplier 1: Digi-Key; Stock 1: 742743; Pricing 1: 1=0.100000, 10=0.034000, 25=0.024400, 50=0.018600, 100=0.013800, 250=0.010480, 500=0.008400, 1000=0.006180 (USD); RoHS: Yes; Mount: Surface Mount; Case/Package: 0603; Weight: 7.1E-05oz; Contact Plating: Tin,Lead; Case Code (Metric): 1608; Case Code (Imperial): 0603; Min Operating Temperature: -55°C; Max Operating Temperature: 155°C; Composition: Thick Film; Termination: SMD/SMT; Packaging: Tape and Reel; Package Quantity: 1; Number of Terminations: 2; Military Standard: Not; Max Power Dissipation: 100mW; Voltage Rating (DC): 75V; Features: Automotive AEC-Q200; Working Voltage: 75V; Length: 1.55mm; Height: 0.02inch; Width: 0.033inch; Depth: 0.85mm; Radiation Hardening: No; Lead Free: Lead Free; REACH SVHC: Unknown; ComponentLink1URL: https://datasheet.ciiva.com/2461/dcrcwe3-2461968.pdf?src-supplier=Digi-Key; ComponentLink1Description: https://datasheet.ciiva.com/2461/dcrcwe3-2461968.pdf?src-supplier=Digi-Key; ComponentLink2URL: https://datasheet.ciiva.com/2461/dcrcwe3-2461969.pdf?src-supplier=Digi-Key; ComponentLink2Description: https://datasheet.ciiva.com/2461/dcrcwe3-2461969.pdf?src-supplier=Digi-Key; ComponentLink3URL: https://datasheet.ciiva.com/2461/dcrcwe3-2461970.pdf?src-supplier=Digi-Key; ComponentLink3Description: https://datasheet.ciiva.com/2461/dcrcwe3-2461970.pdf?src-supplier=Digi-Key; ComponentLink4URL: https://datasheet.ciiva.com/8340/dcrcwe3-8340197.pdf?src-supplier=Avnet; ComponentLink4Description: https://datasheet.ciiva.com/8340/dcrcwe3-8340197.pdf?src-supplier=Avnet; ComponentLink5URL: https://datasheet.ciiva.com/16941/dcrcw-16941302.pdf?src-supplier=Avnet+Europe; ComponentLink5Description: https://datasheet.ciiva.com/16941/dcrcw-16941302.pdf?src-supplier=Avnet+Europe; ComponentLink6URL: https://datasheet.ciiva.com/16199/dcrcwe3-16199063.pdf?src-supplier=Future+Electronics; ComponentLink6Description: https://datasheet.ciiva.com/16199/dcrcwe3-16199063.pdf?src-supplier=Future+Electronics; ComponentLink7URL: https://datasheet.ciiva.com/16725/70201119-16725175.pdf?src-supplier=Allied+Electronics; ComponentLink7Description: https://datasheet.ciiva.com/16725/70201119-16725175.pdf?src-supplier=Allied+Electronics; ComponentLink8URL: https://datasheet.ciiva.com/26316/fld-crcw-e3-data-en-26316615.pdf?src-supplier=Distrelec; ComponentLink8Description: https://datasheet.ciiva.com/26316/fld-crcw-e3-data-en-26316615.pdf?src-supplier=Distrelec; ComponentLink9URL: https://datasheet.ciiva.com/5544/dcrcwe3-109170-5544344.pdf?src-supplier=Mouser; ComponentLink9Description: https://datasheet.ciiva.com/5544/dcrcwe3-109170-5544344.pdf?src-supplier=Mouser; ComponentLink10URL: https://datasheet.ciiva.com/7841/1720486-7841816.pdf?src-supplier=Element14; ComponentLink10Description: https://datasheet.ciiva.com/7841/1720486-7841816.pdf?src-supplier=Element14; ComponentLink11URL: https://datasheet.ciiva.com/7841/1720486-7841817.pdf?src-supplier=Element14; ComponentLink11Description: https://datasheet.ciiva.com/7841/1720486-7841817.pdf?src-supplier=Element14; ComponentLink12URL: https://datasheet.ciiva.com/7841/125364-7841818.pdf?src-supplier=Element14; ComponentLink12Description: https://datasheet.ciiva.com/7841/125364-7841818.pdf?src-supplier=Element14; ComponentLink13URL: https://datasheet.ciiva.com/16721/70201119-16721450.pdf?src-supplier=Allied+Electronics; ComponentLink13Description: https://datasheet.ciiva.com/16721/70201119-16721450.pdf?src-supplier=Allied+Electronics; Supplier Part Number 1: 541-0.0GCT-ND
TP19 TP25 TP26 = TEST_POINT
U12 = BNO085: IMU ACCEL/GYRO/MAG I2C 32BIT; Manufacturer 1: Hillcrest Laboratories; Sensor Type: Accelerometer,Gyroscope,Magnetometer; Output Type: SPI,I2C; Supplier 1: Digi-Key; Manufacturer Part Number 1: BNO085; RoHS: No; Category: Inertial Measurement Units (IMUs); Stock 1: 11593; Pricing 1: 1=11.85000, 5=10.31200, 10=9.28100, 25=8.25000, 50=7.63120, 100=6.60000, 500=6.18750, 1000=5.77500 (USD); Mount: Surface Mount; Case/Package: LGA; Min Operating Temperature: -40°C; Max Operating Temperature: 85°C; Packaging: Tape and Reel; ComponentLink1URL: https://www.hillcrestlabs.com/downloads/bno080-datasheet?src-supplier=Digi-Key; ComponentLink1Description: https://www.hillcrestlabs.com/downloads/bno080-datasheet?src-supplier=Digi-Key; ComponentLink2URL: https://www.hillcrestlabs.com/downloads/bno080-migration-guide?src-supplier=Digi-Key; ComponentLink2Description: https://www.hillcrestlabs.com/downloads/bno080-migration-guide?src-supplier=Digi-Key; Supplier Part Number 1: 1888-1006-1-ND
Y1 = ABS06-127-32.768KHZ-T: CRYSTAL 32.768kHz ±20ppm Crystal 12.5pF 90 kOhms 2-SMD, No Lead; Manufacturer 1: Abracon; ESR (Equivalent Series Resistance): 90kR; Supplier 1: Digi-Key; Manufacturer Part Number 1: ABS06-127-32.768KHZ-T; RoHS: Yes; Stock 1: 1640; Pricing 1: 1=0.69000, 10=0.60700, 50=0.56760, 100=0.50160, 500=0.47520, 1000=0.39600 (USD); Mount: Surface Mount; Case/Package: SMD/SMT; Min Operating Temperature: -40°C; Max Operating Temperature: 85°C; Packaging: Tape and Reel; ComponentLink1URL: http://www.farnell.com/datasheets/2614114.pdf?src-supplier=Farnell; ComponentLink1Description: http://www.farnell.com/datasheets/2614114.pdf?src-supplier=Farnell; ComponentLink2URL: https://abracon.com/datasheets/ABS06-127-32.768kHz-T.pdf?src-supplier=Digi-Key; ComponentLink2Description: https://abracon.com/datasheets/ABS06-127-32.768kHz-T.pdf?src-supplier=Digi-Key; ComponentLink3URL: http://www.farnell.com/datasheets/2614114.pdf?src-supplier=Newark; ComponentLink3Description: http://www.farnell.com/datasheets/2614114.pdf?src-supplier=Newark; Supplier 2: Digi-Key; Supplier 3: Mouser; Supplier 4: Verical; Supplier Part Number 1: 535-14513-1-ND; Supplier Part Number 2: 535-14513-6-ND; Supplier Part Number 3: 815-ABS0612732.768KT; Supplier Part Number 4: ABS06-127-32.768KHZ-T